# EAGLE design 7-segment (EAGLE 7.5.0)
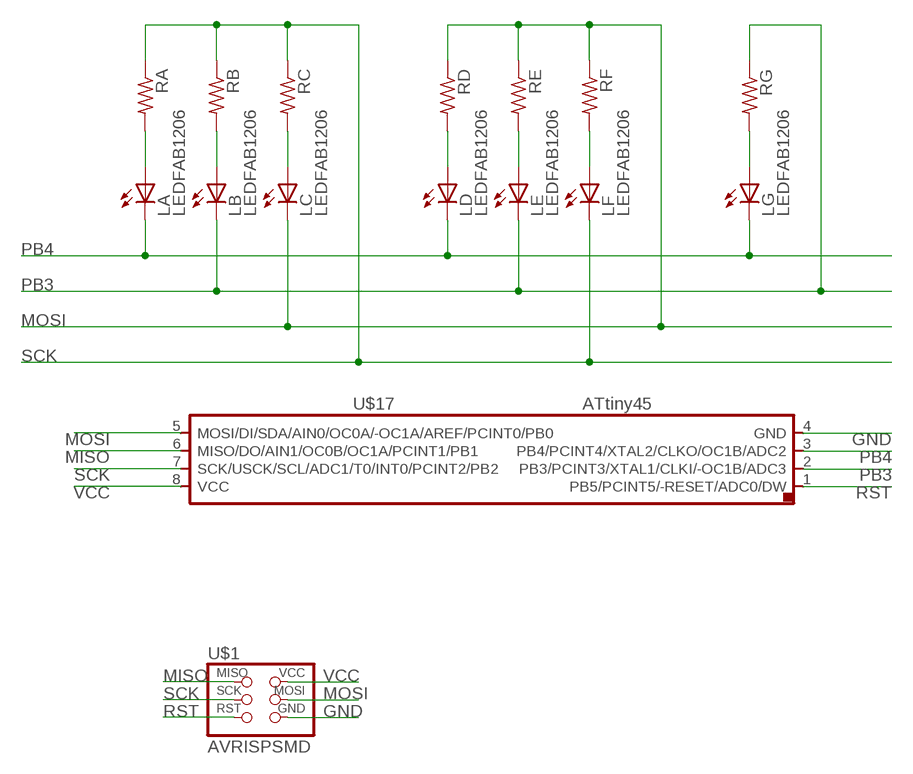
[diagram p0: schematic, sheet 1]

## Parts
LA  LEDFAB1206  [LED1206FAB]
LB  LEDFAB1206  [LED1206FAB]
LC  LEDFAB1206  [LED1206FAB]
LD  LEDFAB1206  [LED1206FAB]
LE  LEDFAB1206  [LED1206FAB]
LF  LEDFAB1206  [LED1206FAB]
LG  LEDFAB1206  [LED1206FAB]
RA  RES-US1206FAB  [R1206FAB]
RB  RES-US1206FAB  [R1206FAB]
RC  RES-US1206FAB  [R1206FAB]
RD  RES-US1206FAB  [R1206FAB]
RE  RES-US1206FAB  [R1206FAB]
RF  RES-US1206FAB  [R1206FAB]
RG  RES-US1206FAB  [R1206FAB]
U$1  AVRISPSMD  [2X03SMD]
U$17  ATTINY45SI  [SOIC8]

## Nets
GND: U$1.6(GND) U$17.4(GND)
MISO: U$1.1(MISO) U$17.6(MISO/DO/AIN1/OC0B/OC1A/PCINT1/PB1)
MOSI: LC.2(C) RD.1 RE.1 RF.1 U$1.4(MOSI) U$17.5(MOSI/DI/SDA/AIN0/OC0A/-OC1A/AREF/PCINT0/PB0)
N$1: LA.1(A) RA.2
N$2: LB.1(A) RB.2
N$3: LC.1(A) RC.2
N$4: LD.1(A) RD.2
N$5: LE.1(A) RE.2
N$6: LF.1(A) RF.2
N$7: LG.1(A) RG.2
PB3: LB.2(C) LE.2(C) RG.1 U$17.2(PB3/PCINT3/XTAL1/CLKI/-OC1B/ADC3)
PB4: LA.2(C) LD.2(C) LG.2(C) U$17.3(PB4/PCINT4/XTAL2/CLKO/OC1B/ADC2)
RST: U$1.5(RST) U$17.1(PB5/PCINT5/-RESET/ADC0/DW)
SCK: LF.2(C) RA.1 RB.1 RC.1 U$1.3(SCK) U$17.7(SCK/USCK/SCL/ADC1/T0/INT0/PCINT2/PB2)
VCC: U$1.2(VCC) U$17.8(VCC)

## Library data of the parts
LA LB LC LD LE LF LG = fab:LED: LED
RA RB RC RD RE RF RG = fab:RES-US: Resistor (US Symbol) Variants with postfix FAB are widened to allow the routing of internal traces
U$1 = fab:AVRISP
U$17 = fab:ATTINY45

## Net classes
0 default: width 0.457 mm, clearance 1.626 mm

## Board
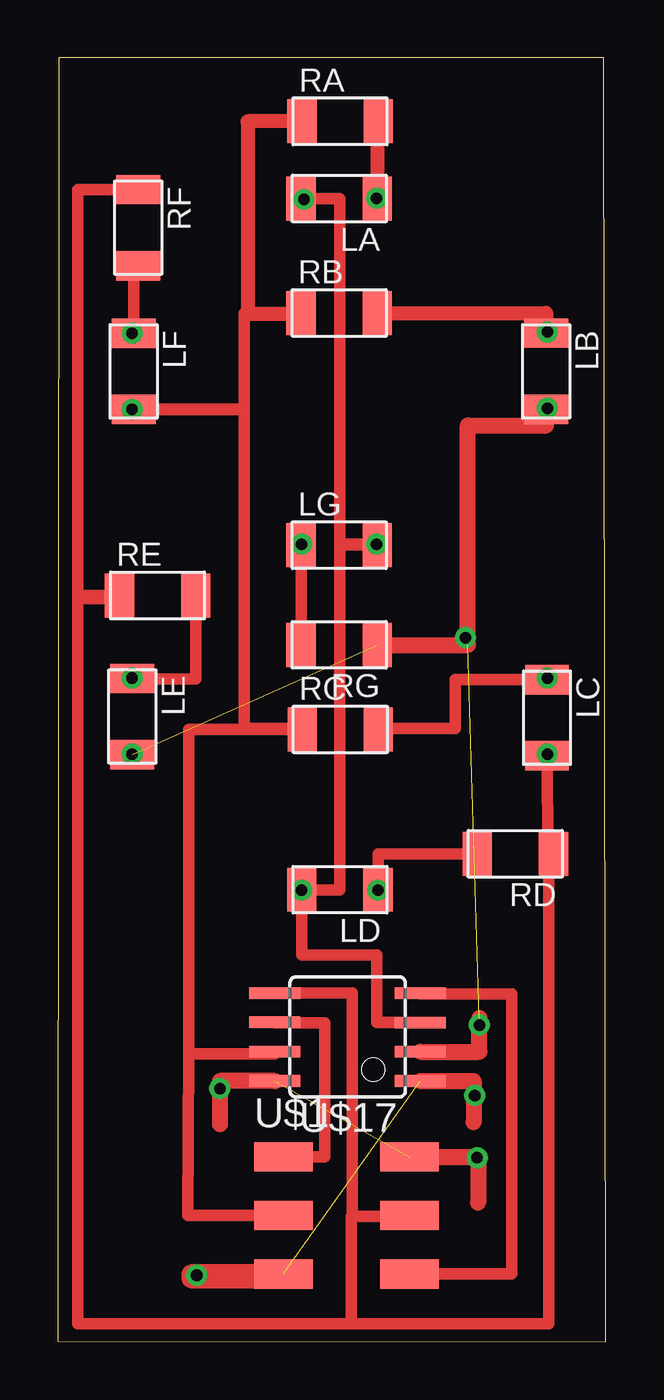
[diagram p1: board, top side]

Size 23.77 x 55.68 mm. Coordinates in mm from the lower left corner, seen from the top.
Outline: 0,0.02 23.77,0 23.67,55.68 0.05,55.68 0,0.02
Copper layers (1*16): Top 0.035mm / dielectric 1.5mm / Bottom 0.035mm
Design rules "fab": minimum track width 0.3mm, minimum drill 32mil, track to track 0.397mm, track to pad 0.397mm, pad to pad 0.397mm, via to via 0.397mm, smd to smd 0.315mm, copper to edge 40mil, drill to drill 16mil, minimum pad ring 10mil, minimum via ring 8mil, stop-mask expansion 4mil, vias tented up to drill 0mil, thermal gap 10mil

### Footprints (pad centres in the part's own frame; a part is rotated, then mirrored left to right if it is on the bottom)
LED1206FAB = smd 1.27 x 1.905: 1 -1.651,0; 2 1.651,0
R1206FAB = smd 1.27 x 1.905: 1 -1.651,0; 2 1.651,0
2X03SMD = smd 2.54 x 1.27: 1 -2.54,2.54; 2 2.92,2.54; 3 -2.54,0; 4 2.92,0; 5 -2.54,-2.54; 6 2.92,-2.54
SOIC8 = smd 0.5 x 2.2: 1 -1.905,-3.154; 2 -0.645,-3.154; 3 0.625,-3.154; 4 1.895,-3.154; 5 1.905,3.154; 6 0.635,3.154; 7 -0.635,3.154; 8 -1.905,3.154

### Placement (x,y rotation side)
LA  12.2,49.57 180 top
LB  21.17,42.08 270 top
LC  21.21,27.06 270 top
LD  12.23,19.61 180 top
LE  3.24,27.11 270 top
LF  3.29,42.08 270 top
LG  12.2,34.54 0 top
RA  12.24,52.92 0 top
RB  12.2,44.61 0 top
RC  12.25,26.55 0 top
RD  19.84,21.16 180 top
RE  4.33,32.36 0 top
RF  3.49,48.31 270 top
RG  12.2,30.22 180 top
U$1  12.33,5.49 0 top
U$17  12.57,13.22 90 top

### Tracks (layer width: path | path; a pad name or v marks a point on that pad's centre or on a via)
GND
  Top 0.508: U$1.6 19.68,2.94 19.68,15.08 15.72,15.08 U$17.4
MISO
  Top 0.508: U$1.1 11.58,8.02 11.58,13.83 9.41,13.83 U$17.6
MOSI
  Top 0.508: RF.1 0.88,49.96 0.88,32.23 2.68,32.23 RE.1 0.88,32.36 0.88,0.79 12.73,0.79 | LC.2 21.24,21.21 RD.1 21.28,21.26 21.28,0.79 12.73,0.79 | 12.73,0.79 12.73,5.44 12.78,5.44 | 12.78,5.44 15.25,5.44 U$1.4 | 12.78,5.44 12.78,15.13 U$17.5
N$1
  Top 0.61: RA.2 13.85,52.92 LA.1
N$2
  Top 0.61: RB.2 21.17,44.61 LB.1
N$3
  Top 0.508: 13.9,27.06 RC.2 13.9,26.59 17.23,26.59 17.23,28.71 LC.1
N$4
  Top 0.508: RD.2 13.88,21.16 LD.1
N$5
  Top 0.508: RE.2 5.98,28.73 3.24,28.73 LE.1
N$6
  Top 0.508: RF.2 3.29,46.66 LF.1
N$7
  Top 0.508: LG.1 RG.2
N$8  (via drill 0.5 pad 0.41)
  other vias: 10.68,49.53
N$9  (via drill 0.5 pad 0.41)
  other vias: 13.83,49.59
N$10  (via drill 0.5 pad 0.41)
  other vias: 3.23,43.73
N$11  (via drill 0.5 pad 0.41)
  other vias: 3.23,40.44
N$12  (via drill 0.5 pad 0.41)
  other vias: 21.23,43.78
N$13  (via drill 0.5 pad 0.41)
  other vias: 21.23,40.48
N$14  (via drill 0.5 pad 0.41)
  other vias: 10.58,34.59
N$15  (via drill 0.5 pad 0.41)
  other vias: 17.68,30.54
N$16  (via drill 0.5 pad 0.41)
  other vias: 3.23,25.48
N$17  (via drill 0.5 pad 0.41)
  other vias: 10.58,19.59
N$18  (via drill 0.5 pad 0.41)
  other vias: 13.88,19.59
N$19  (via drill 0.5 pad 0.41)
  other vias: 3.23,28.79
N$20  (via drill 0.5 pad 0.41)
  other vias: 21.23,28.79
N$21  (via drill 0.5 pad 0.41)
  other vias: 21.23,25.48
N$22  (via drill 0.5 pad 0.41)
  other vias: 18.28,13.73
N$23  (via drill 0.5 pad 0.41)
  other vias: 18.08,10.68
N$24  (via drill 0.5 pad 0.41)
  other vias: 6.03,2.88
N$25  (via drill 0.5 pad 0.41)
  other vias: 18.18,7.99
N$26  (via drill 0.5 pad 0.41)
  other vias: 7.03,10.98
PB3  (2 unrouted)
  Top 0.7: U$17.2 18.28,12.58 18.28,14.04 | RG.1 17.78,30.22 17.78,39.73 21.17,39.73 LB.2
PB4  (via drill 0.5 pad 0.41)
  Top 0.508: LA.2 12.23,49.57 12.23,34.59 v13.83,34.59 13.85,34.59 LG.2 12.23,34.54 12.23,19.59 10.58,19.59 LD.2 10.58,16.79 13.83,16.79 13.83,13.85 U$17.3
RST  (1 unrouted)
  Top 0.7: U$17.1 18.03,11.32 18.03,9.54
  Top 0.813: U$1.5 5.78,2.94 5.78,2.73 8.78,2.73
SCK
  Top 0.508: RB.1 8.08,44.61 8.08,40.44 LF.2 8.08,40.43 8.08,26.59 10.6,26.59 RC.1 | RC.1 10.62,26.55 | RC.1 5.68,26.55 5.68,12.48 | 5.68,12.48 9.41,12.48 U$17.7 | U$1.3 5.63,5.49 5.68,12.48
  Top 0.61: RA.1 8.23,52.92 8.23,44.59 10.55,44.59 RB.1
VCC  (1 unrouted)
  Top 0.7: U$17.8 7.03,11.32 7.03,9.43 | U$1.2 18.23,8.02 18.23,6.04